# EasyEDA schematic oLoRa-part-Coprocessor.json
TITLE: oLoRa-part-Coprocessor; REV: 1.0; Date: 2019-08-19; Sheet: 1/1; Drawn By: 김석현; Company: RMTEC
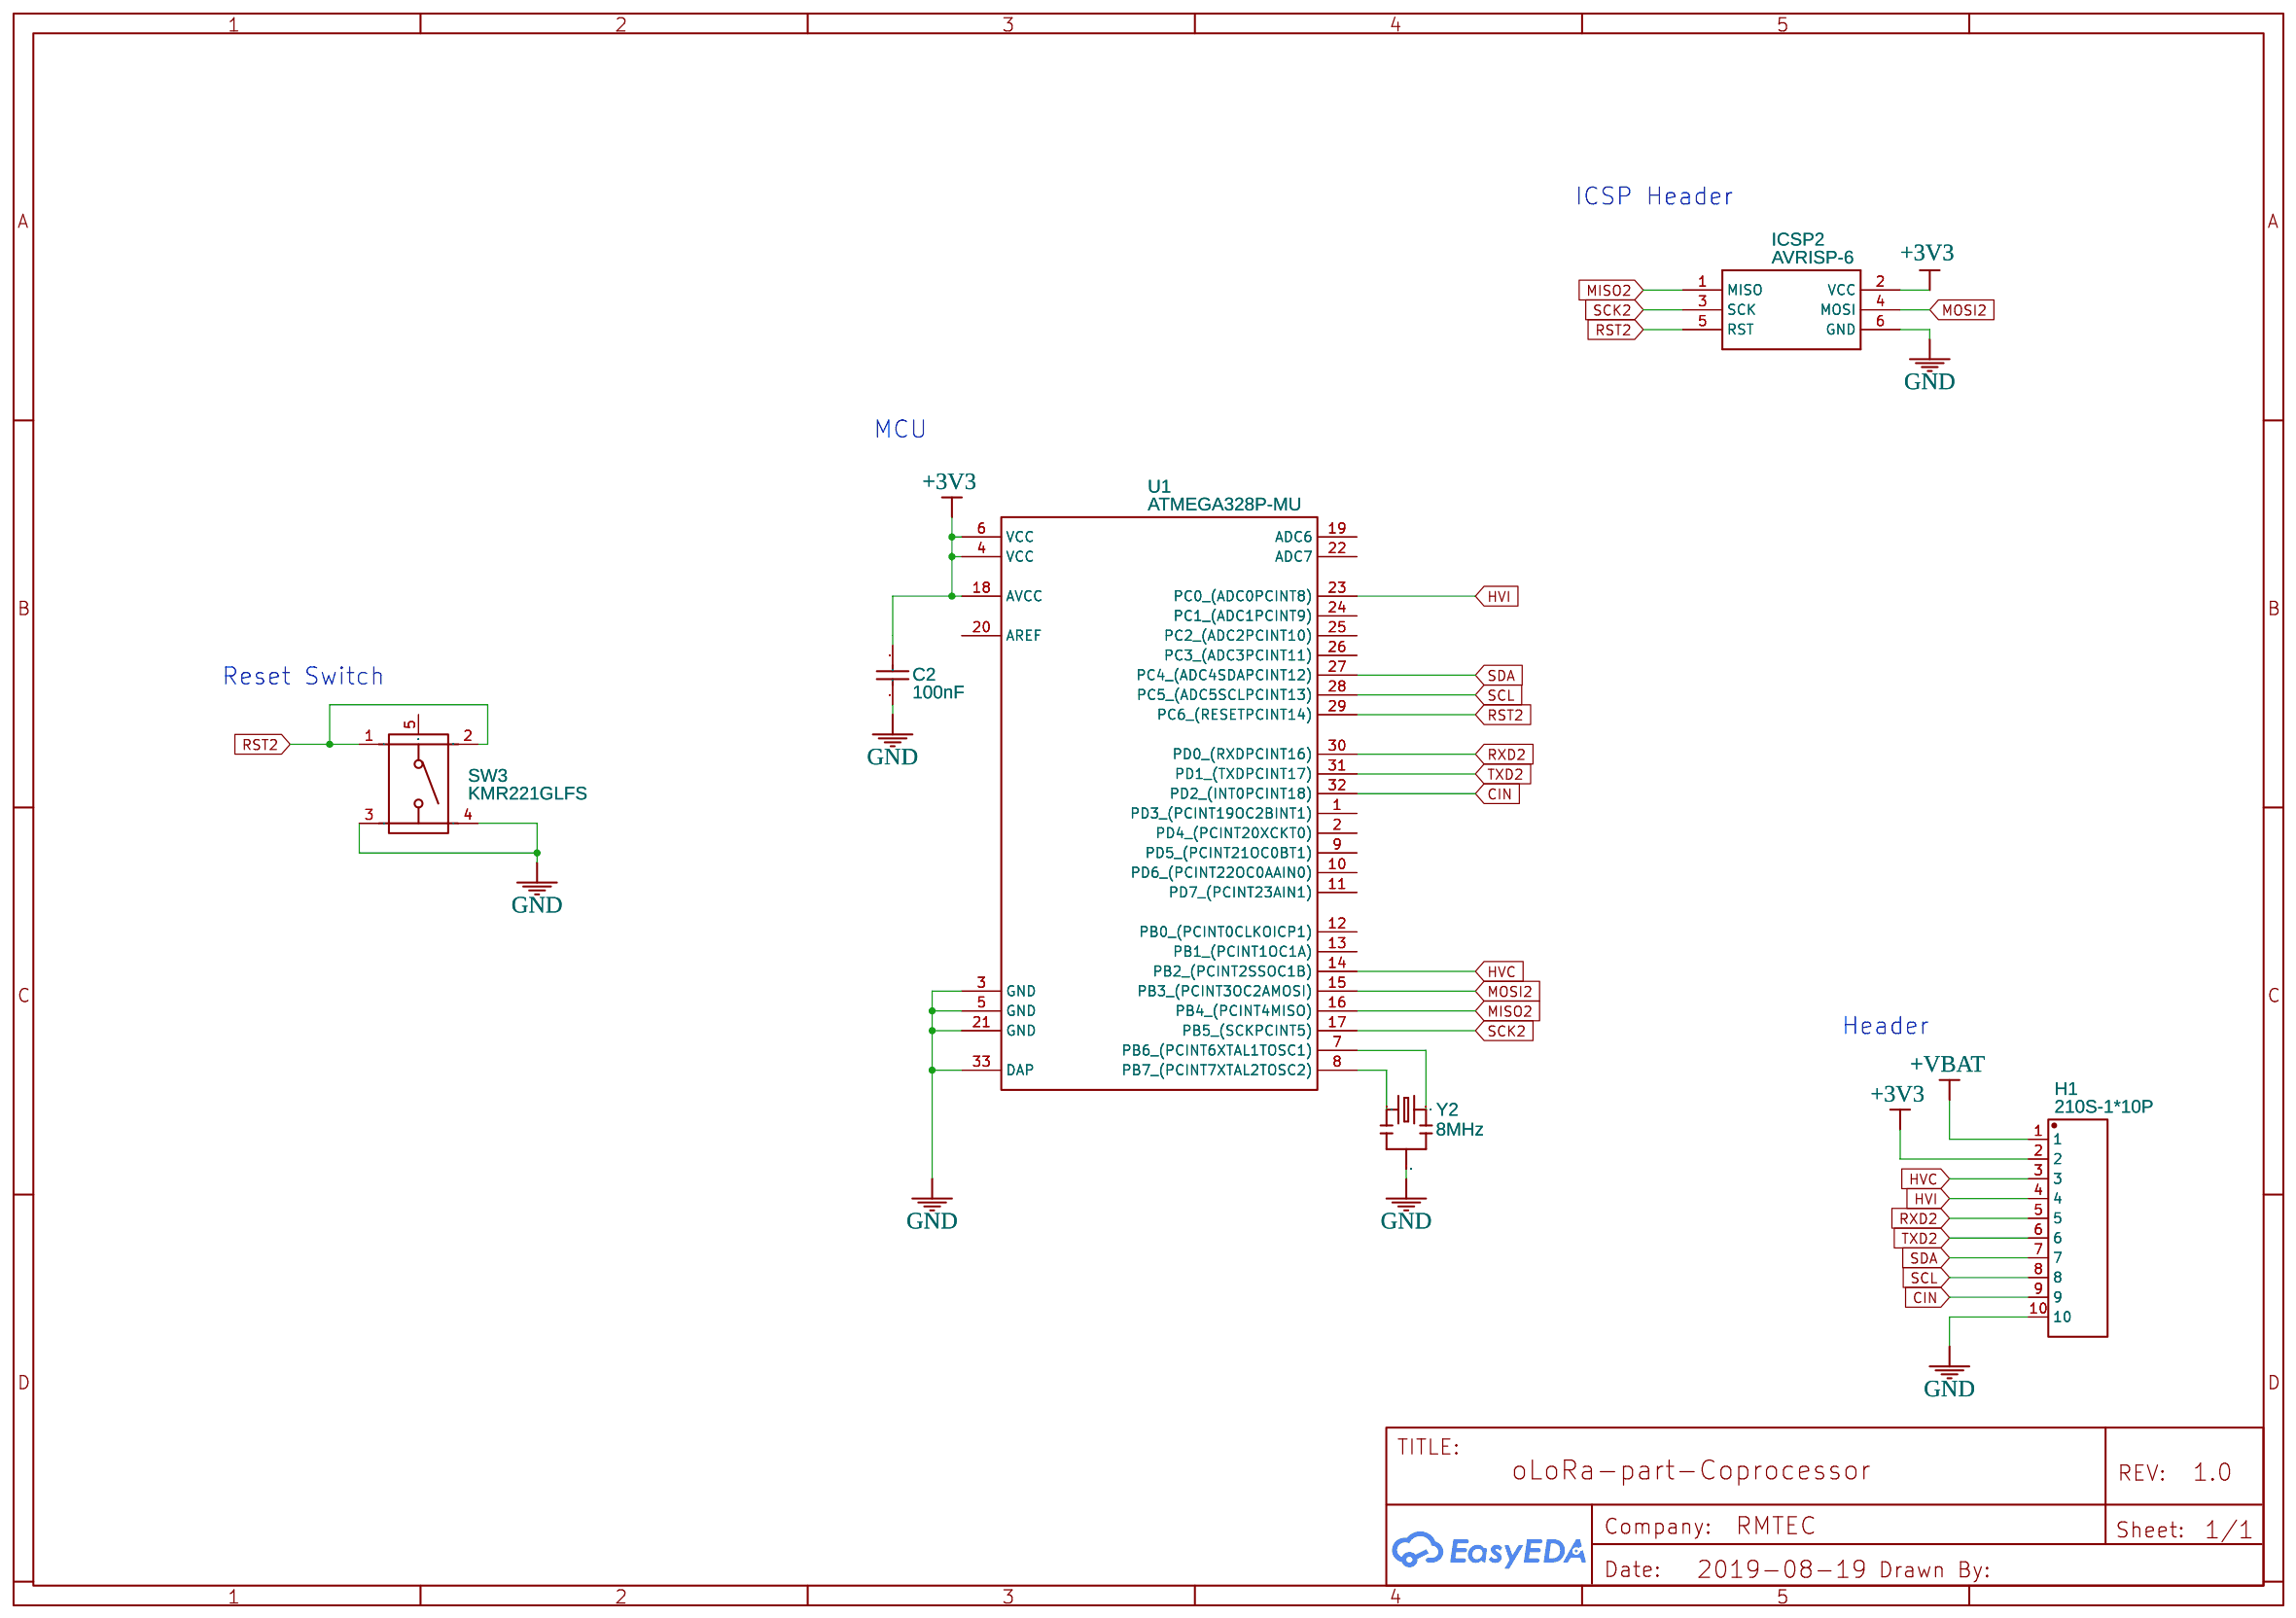
[diagram p0: schematic sheet]

## Parts
C2  100nF  [0603]
H1  210S-1*10P  [210S-1X10P]
ICSP2  AVRISP-6  [AVRISP]
SW3  KMR221GLFS  [KEY-SMD-4.6X2.8X1.9]
U1  ATMEGA328P-MU  [QFN-32_5X5X05P]
Y2  8MHz  [X3-SMD-3.6X1.3X0.8MM]

## Library data of the parts
C2 = 0603B104K500NT: Supplier: LCSC; Manufacturer: FH; Supplier Part: C30926
H1 = -: Supplier: LCSC; Manufacturer: Ckmtw; Manufacturer Part: 210S-1*10P L=11.6MMGold-plated black; Contributor: LCSC; Supplier Part: C124372
ICSP2 = -: AVR ISP HEADER; Contributor: Adafruit; Manufacturer Part: ?
SW3 = -: Supplier: LCSC; Supplier Part: C72443; Manufacturer: C&K; Contributor: LCSC
U1 = -: Supplier: LCSC; Manufacturer: MICROCHIP; image: //image.lceda.cn/szlcsc/C38896.jpg; Supplier Part: C38896
Y2 = -: SMD Resonator 8MHz-33pF-0.1%;; Manufacturer Part: CSTCE8M00G55-R0

## Nets
+3V3: C2.1 H1.2 ICSP2.2(VCC) U1.4(VCC) U1.6(VCC) U1.18(AVCC)
+VBAT: H1.1
GND: C2.2 H1.10 ICSP2.6(GND) SW3.3 SW3.4 U1.3(GND) U1.5(GND) U1.21(GND) U1.33(DAP) Y2.2
CIN: H1.9 U1.32(PD2 (INT0PCINT18))
HVC: H1.3 U1.14(PB2 (PCINT2SSOC1B))
HVI: H1.4 U1.23(PC0 (ADC0PCINT8))
MISO2: ICSP2.1(MISO) U1.16(PB4 (PCINT4MISO))
MOSI2: ICSP2.4(MOSI) U1.15(PB3 (PCINT3OC2AMOSI))
RST2: ICSP2.5(RST) SW3.1 SW3.2 U1.29(PC6 (RESETPCINT14))
RXD2: H1.5 U1.30(PD0 (RXDPCINT16))
SCK2: ICSP2.3(SCK) U1.17(PB5 (SCKPCINT5))
SCL: H1.8 U1.28(PC5 (ADC5SCLPCINT13))
SDA: H1.7 U1.27(PC4 (ADC4SDAPCINT12))
TXD2: H1.6 U1.31(PD1 (TXDPCINT17))
Net-(U1-7): U1.7(PB6 (PCINT6XTAL1TOSC1)) Y2.3
Net-(U1-8): U1.8(PB7 (PCINT7XTAL2TOSC2)) Y2.1

Not connected (* = marked no-connect by the designer): SW3 5; U1 1(PD3 (PCINT19OC2BINT1)) 2(PD4 (PCINT20XCKT0)) 9(PD5 (PCINT21OC0BT1)) 10(PD6 (PCINT22OC0AAIN0)) 11(PD7 (PCINT23AIN1)) 12(PB0 (PCINT0CLKOICP1)) 13(PB1 (PCINT1OC1A)) 19(ADC6) 20(AREF) 22(ADC7) 24(PC1 (ADC1PCINT9)) 25(PC2 (ADC2PCINT10)) 26(PC3 (ADC3PCINT11))

## Notes on the sheet
- ICSP Header
- MCU
- Reset Switch
- Header
